# Altium schematic sheet 02-Memory.SchDoc
size A3
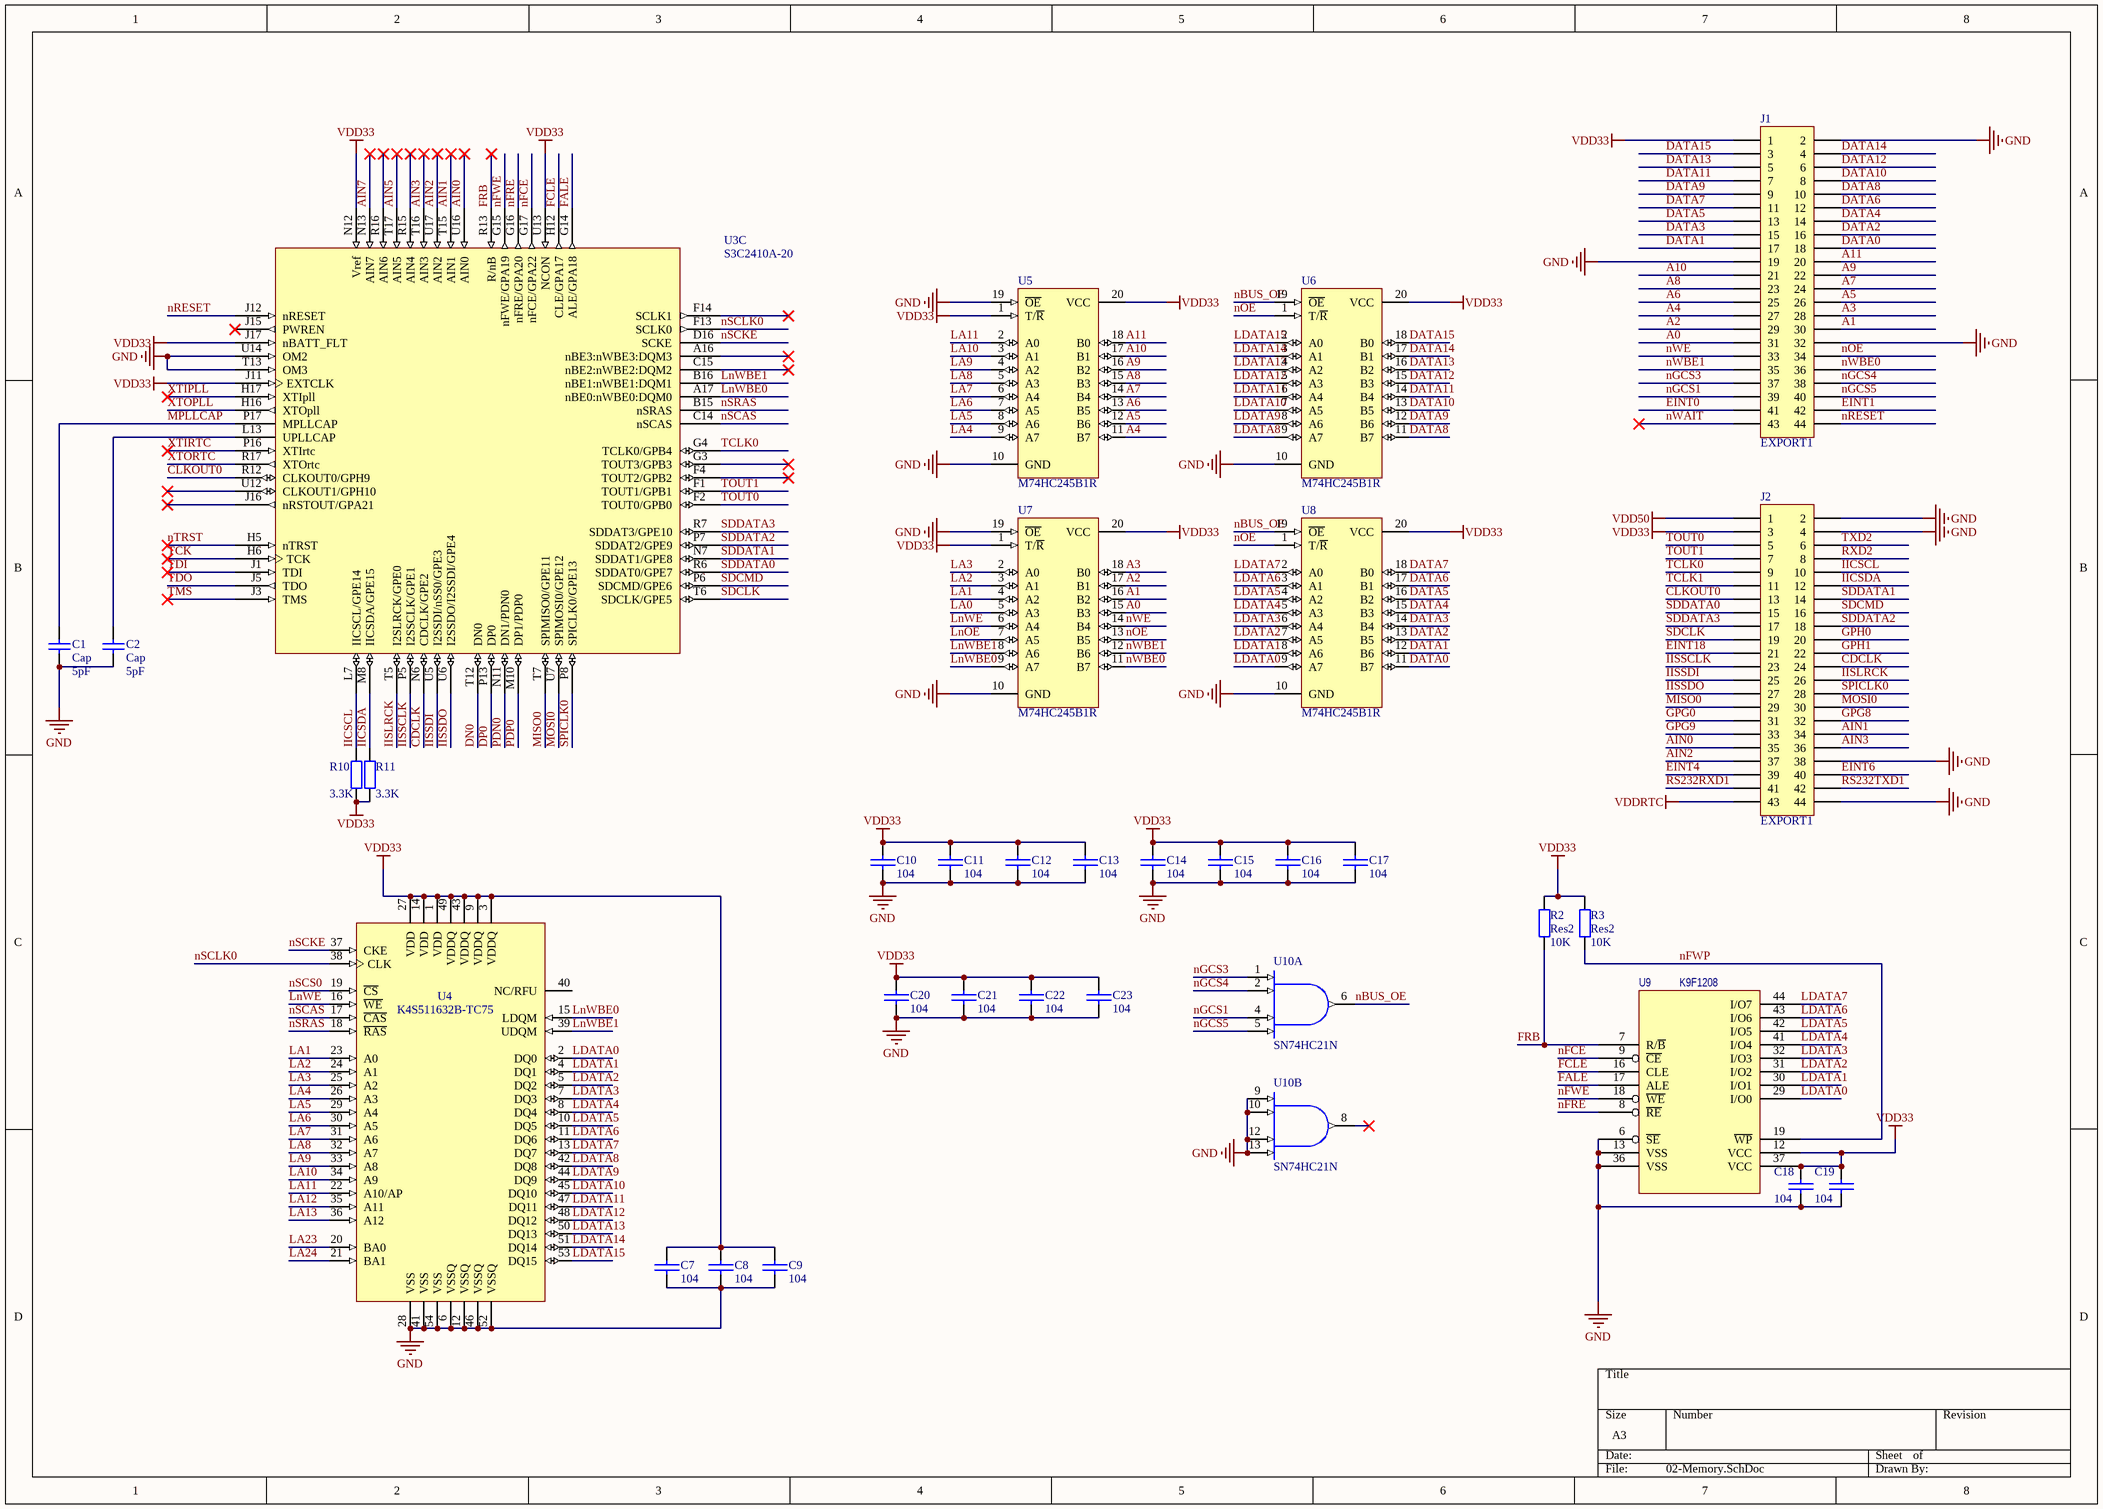
[diagram p0: 02-Memory.SchDoc]

## Parts
C1  Cap  value 5pF  [RAD-0.3]
C2  Cap  value 5pF  [RAD-0.3]
C7  104  [A型钽电容]
C8  104  [A型钽电容]
C9  104  [A型钽电容]
C10  104  [A型钽电容]
C11  104  [A型钽电容]
C12  104  [A型钽电容]
C13  104  [A型钽电容]
C14  104  [A型钽电容]
C15  104  [A型钽电容]
C16  104  [A型钽电容]
C17  104  [A型钽电容]
C18  104  [A型钽电容]
C19  104  [A型钽电容]
C20  104  [A型钽电容]
C21  104  [A型钽电容]
C22  104  [A型钽电容]
C23  104  [A型钽电容]
J1  EXPORT1  [HDR2X22]
J2  EXPORT1  [HDR2X22]
R2  Res2  value 10K  [0603R]
R3  Res2  value 10K  [0603R]
R10  value 3.3K  [0603R]  (hidden comment: Res2)
R11  value 3.3K  [0603R]  (hidden comment: Res2)
U3  S3C2410A-20  [FBGA272]  (part C of 4)
U4  K4S511632B-TC75  [54_TSOP2_400AF_N]
U5  M74HC245B1R  [SOP-20]
U6  M74HC245B1R  [SOP-20]
U7  M74HC245B1R  [SOP-20]
U8  M74HC245B1R  [SOP-20]
U9  K9F1208  [TSOP48]
U10  SN74HC21N  [N014]  (parts A,B of 2)

## Nets
GND: C1.1 C2.1 C7.2 C8.2 C9.2 C10.2 C11.2 C12.2 C13.2 C14.2 C15.2 C16.2 C17.2 C18.2 C19.2 C20.2 C21.2 C22.2 C23.2 J1.2 J1.19 J1.32 J2.2 J2.4 J2.38 J2.44 U3.T13(OM3) U3.U14(OM2) U4.6(VSSQ) U4.12(VSSQ) U4.28(VSS) U4.41(VSS) U4.46(VSSQ) U4.52(VSSQ) U4.54(VSS) U5.10(GND) U5.19(~{OE}) U6.10(GND) U7.10(GND) U7.19(~{OE}) U8.10(GND) U9.6(~{SE}) U9.13(VSS) U9.36(VSS) U10.7(GND) U10.9(A) U10.10(B) U10.12(C) U10.13(D)
VCC: U10.14(VCC)
VDD33: C7.1 C8.1 C9.1 C10.1 C11.1 C12.1 C13.1 C14.1 C15.1 C16.1 C17.1 C18.1 C19.1 C20.1 C21.1 C22.1 C23.1 J1.1 J2.3 R2.2 R3.2 R10.1 R11.1 U3.J11(EXTCLK) U3.J17(nBATT_FLT) U3.N12(Vref) U3.U13(NCON) U4.1(VDD) U4.3(VDDQ) U4.9(VDDQ) U4.14(VDD) U4.27(VDD) U4.43(VDDQ) U4.49(VDDQ) U5.1(T/~{R}) U5.20(VCC) U6.20(VCC) U7.1(T/~{R}) U7.20(VCC) U8.20(VCC) U9.12(VCC) U9.37(VCC)
VDD50: J2.1
VDDRTC: J2.43
A0: J1.31 U7.15(B3)
A1: J1.30 U7.16(B2)
A2: J1.29 U7.17(B1)
A3: J1.28 U7.18(B0)
A4: J1.27 U5.11(B7)
A5: J1.26 U5.12(B6)
A6: J1.25 U5.13(B5)
A7: J1.24 U5.14(B4)
A8: J1.23 U5.15(B3)
A9: J1.22 U5.16(B2)
A10: J1.21 U5.17(B1)
A11: J1.20 U5.18(B0)
AIN0: J2.35 U3.U16(AIN0)
AIN1: J2.34 U3.T15(AIN1)
AIN2: J2.37 U3.U17(AIN2)
AIN3: J2.36 U3.T16(AIN3)
AIN5: U3.T17(AIN5)
AIN7: U3.N13(AIN7)
CDCLK: J2.24 U3.N6(CDCLK/GPE2)
CLKOUT0: J2.13 U3.R12(CLKOUT0/GPH9)
DATA0: J1.18 U8.11(B7)
DATA1: J1.17 U8.12(B6)
DATA2: J1.16 U8.13(B5)
DATA3: J1.15 U8.14(B4)
DATA4: J1.14 U8.15(B3)
DATA5: J1.13 U8.16(B2)
DATA6: J1.12 U8.17(B1)
DATA7: J1.11 U8.18(B0)
DATA8: J1.10 U6.11(B7)
DATA9: J1.9 U6.12(B6)
DATA10: J1.8 U6.13(B5)
DATA11: J1.7 U6.14(B4)
DATA12: J1.6 U6.15(B3)
DATA13: J1.5 U6.16(B2)
DATA14: J1.4 U6.17(B1)
DATA15: J1.3 U6.18(B0)
DN0: U3.T12(DN0)
DP0: U3.P13(DP0)
EINT0: J1.41
EINT1: J1.42
EINT4: J2.39
EINT6: J2.40
EINT18: J2.21
FALE: U3.G14(ALE/GPA18) U9.17(ALE)
FCLE: U3.H12(CLE/GPA17) U9.16(CLE)
FRB: R2.1 U3.R13(R/nB) U9.7(R/~{B})
GPG0: J2.31
GPG8: J2.32
GPG9: J2.33
GPH0: J2.20
GPH1: J2.22
IICSCL: J2.10 R10.2 U3.L7(IICSCL/GPE14)
IICSDA: J2.12 R11.2 U3.M8(IICSDA/GPE15)
IISLRCK: J2.26 U3.T5(I2SLRCK/GPE0)
IISSCLK: J2.23 U3.P5(I2SSCLK/GPE1)
IISSDI: J2.25 U3.U5(I2SSDI/nSS0/GPE3)
IISSDO: J2.27 U3.U6(I2SSDO/I2SSDI/GPE4)
LA0: U7.5(A3)
LA1: U4.23(A0) U7.4(A2)
LA2: U4.24(A1) U7.3(A1)
LA3: U4.25(A2) U7.2(A0)
LA4: U4.26(A3) U5.9(A7)
LA5: U4.29(A4) U5.8(A6)
LA6: U4.30(A5) U5.7(A5)
LA7: U4.31(A6) U5.6(A4)
LA8: U4.32(A7) U5.5(A3)
LA9: U4.33(A8) U5.4(A2)
LA10: U4.34(A9) U5.3(A1)
LA11: U4.22(A10/AP) U5.2(A0)
LA12: U4.35(A11)
LA13: U4.36(A12)
LA23: U4.20(BA0)
LA24: U4.21(BA1)
LDATA0: U4.2(DQ0) U8.9(A7) U9.29(I/O0)
LDATA1: U4.4(DQ1) U8.8(A6) U9.30(I/O1)
LDATA2: U4.5(DQ2) U8.7(A5) U9.31(I/O2)
LDATA3: U4.7(DQ3) U8.6(A4) U9.32(I/O3)
LDATA4: U4.8(DQ4) U8.5(A3) U9.41(I/O4)
LDATA5: U4.10(DQ5) U8.4(A2) U9.42(I/O5)
LDATA6: U4.11(DQ6) U8.3(A1) U9.43(I/O6)
LDATA7: U4.13(DQ7) U8.2(A0) U9.44(I/O7)
LDATA8: U4.42(DQ8) U6.9(A7)
LDATA9: U4.44(DQ9) U6.8(A6)
LDATA10: U4.45(DQ10) U6.7(A5)
LDATA11: U4.47(DQ11) U6.6(A4)
LDATA12: U4.48(DQ12) U6.5(A3)
LDATA13: U4.50(DQ13) U6.4(A2)
LDATA14: U4.51(DQ14) U6.3(A1)
LDATA15: U4.53(DQ15) U6.2(A0)
LnOE: U7.7(A5)
LnWBE0: U3.A17(nBE0:nWBE0:DQM0) U4.15(LDQM) U7.9(A7)
LnWBE1: U3.B16(nBE1:nWBE1:DQM1) U4.39(UDQM) U7.8(A6)
LnWE: U4.16(~{WE}) U7.6(A4)
MISO0: J2.29 U3.T7(SPIMISO0/GPE11)
MOSI0: J2.30 U3.U7(SPIMOSI0/GPE12)
MPLLCAP: C1.2 U3.P17(MPLLCAP)
nBUS_OE: U6.19(~{OE}) U8.19(~{OE}) U10.6(Y)
nFCE: U3.G17(nFCE/GPA22) U9.9(~{CE})
nFRE: U3.G16(nFRE/GPA20) U9.8(~{RE})
nFWE: U3.G15(nFWE/GPA19) U9.18(~{WE})
nFWP: R3.1 U9.19(~{WP})
nGCS1: J1.39 U10.4(C)
nGCS3: J1.37 U10.1(A)
nGCS4: J1.38 U10.2(B)
nGCS5: J1.40 U10.5(D)
nOE: J1.34 U6.1(T/~{R}) U7.13(B5) U8.1(T/~{R})
nRESET: J1.44 U3.J12(nRESET)
nSCAS: U3.C14(nSCAS) U4.17(~{CAS})
nSCKE: U3.D16(SCKE) U4.37(CKE)
nSCLK0: U3.F13(SCLK0) U4.38(CLK)
nSCS0: U4.19(~{CS})
nSRAS: U3.B15(nSRAS) U4.18(~{RAS})
nTRST: U3.H5(nTRST)
nWAIT: J1.43
nWBE0: J1.36 U7.11(B7)
nWBE1: J1.35 U7.12(B6)
nWE: J1.33 U7.14(B4)
PDN0: U3.N11(DN1/PDN0)
PDP0: U3.M10(DP1/PDP0)
RS232RXD1: J2.41
RS232TXD1: J2.42
RXD2: J2.8
SDCLK: J2.19 U3.T6(SDCLK/GPE5)
SDCMD: J2.16 U3.P6(SDCMD/GPE6)
SDDATA0: J2.15 U3.R6(SDDAT0/GPE7)
SDDATA1: J2.14 U3.N7(SDDAT1/GPE8)
SDDATA2: J2.18 U3.P7(SDDAT2/GPE9)
SDDATA3: J2.17 U3.R7(SDDAT3/GPE10)
SPICLK0: J2.28 U3.P8(SPICLK0/GPE13)
TCK: U3.H6(TCK)
TCLK0: J2.9 U3.G4(TCLK0/GPB4)
TCLK1: J2.11
TDI: U3.J1(TDI)
TDO: U3.J5(TDO)
TMS: U3.J3(TMS)
TOUT0: J2.5 U3.F2(TOUT0/GPB0)
TOUT1: J2.7 U3.F1(TOUT1/GPB1)
TXD2: J2.6
XTIPLL: U3.H17(XTIpll)
XTIRTC: U3.P16(XTIrtc)
XTOPLL: U3.H16(XTOpll)
XTORTC: U3.R17(XTOrtc)
NetC2_2: C2.2 U3.L13(UPLLCAP)

Not connected (* = marked no-connect by the designer): U3 A16(nBE3:nWBE3:DQM3)* C15(nBE2:nWBE2:DQM2)* F4(TOUT2/GPB2)* F14(SCLK1)* G3(TOUT3/GPB3)* J15(PWREN)* J16(nRSTOUT/GPA21)* R15(AIN4)* R16(AIN6)* U12(CLKOUT1/GPH10)*; U4 40(NC/RFU); U10 8(Y)*

## Library data of the parts
C1 C2 = Cap: Capacitor; Published: 8-Jun-2000; LatestRevisionDate: 17-Jul-2002; LatestRevisionNote: Re-released for DXP Platform.; PackageReference: RAD-0.3; Publisher: Altium Limited; PackageDescription: Radial Cap, Thru-Hole; 2 Leads; 0.3 in Pin Spacing
C7-C23 = CAP_1: Capacitor
J1 J2 = Header 22X2: Header, 22-Pin, Dual row; LatestRevisionDate: 17-Jul-2002; LatestRevisionNote: Re-released for DXP Platform.; Publisher: Altium Limited
R2 R3 = Res2: Resistor; Published: 8-Jun-2000; LatestRevisionDate: 17-Jul-2002; LatestRevisionNote: Re-released for DXP Platform.; PackageReference: AXIAL-0.4; Publisher: Altium Limited
R10 R11 = Res2_1: Resistor; Published: 8-Jun-2000; LatestRevisionDate: 17-Jul-2002; LatestRevisionNote: Re-released for DXP Platform.; PackageReference: AXIAL-0.4; Publisher: Altium Limited
U3 = S3C2410A-20: 32-Bit RISC Microprocessor, 200 MHz, 1.8V (Core), 3.3V (Memory and IO), 272-Pin FBGA; Published: 6-Oct-2005; LatestRevisionDate: 13-Apr-2006; LatestRevisionNote: IPC-7351 Footprint Added.; DatasheetVersion: rev1.0, Mar-2004; PackageVersion: Mar-2004; PackageReference: FBGA272; Publisher: Altium Limited; PackageDescription: 272-Ball Ball Grid Array 0.8 mm Pitch; ComponentLink1Description: Manufacturer Link; ComponentLink1URL: http://www.samsung.com; ComponentLink2Description: Datasheet; ComponentLink2URL: http://www.samsung.com/Products/Semiconductor/SystemLSI/MobileSolutions/MobileASSP/MobileComputing/S3C2410/um_s3c2410a_manual_r10.pdf
U4 = K4S511632B-TC75: 512Mb Synchronous High Data Rate DRAM, 8Mb x 16Bit x 4 Banks, 54-Pin TSOP; Frequency: 133MHz (max); RowAddress: A0-A12; ColumnAddress: A0-A9; Published: 11-Oct-2004; LatestRevisionDate: 13-Apr-2006; LatestRevisionNote: IPC-7351 Footprint Added.; DatasheetVersion: rev1.1, Feb-2004; PackageVersion: Aug-2004; PackageReference: 54_TSOP2_400AF; Publisher: Altium Limited; PackageDescription: 54-Pin Small Outline Package 0.8 mm Pitch; ComponentLink1Description: Manufacturer Link; ComponentLink1URL: http://www.samsung.com; ComponentLink2Description: Datasheet; ComponentLink2URL: http://www.samsung.com/Products/Semiconductor/DRAM/SDRAM/SDRAMcomponent/512Mbit/K4S510432B/ds_sdr_512mb_b-die_x4x8x16_11.pdf
U5-U8 = M74HC245B1R: Octal Bus Transceiver 3-State Non-Inverting; Published: 8-Jun-2000; LatestRevisionDate: 06-Jun-2005; LatestRevisionNote: Stylized 3D Model Added.; DatasheetVersion: Oct-1993; PackageVersion: Jun-1998; PackageReference: DIP20; Publisher: Altium Limited; PackageDescription: DIP; 20 Leads; Row Spacing 7.62 mm; Pitch 2.54 mm; Code_JEDEC: MS-015-AE; ComponentLink1Description: Manufacturer Link; ComponentLink1URL: http://www.st.com/; ComponentLink2Description: Datasheet; ComponentLink2URL: http://www.st.com/stonline/products/literature/ds/1930/m74hc245.pdf
U9 = K9F2808
U10 = SN74HC21N: Dual 4-Input Positive-AND Gate; Note: Pins 3 and 11 are not connected and not drawn; Published: 8-Jun-2000; LatestRevisionDate: 04-Mar-2005; LatestRevisionNote: Stylized 3D Model Added.; DatasheetVersion: May-1997; PackageVersion: Oct-1995; PackageReference: N014; Publisher: Altium Limited; PackageDescription: DIP; 14 Leads; Row Spacing 7.62 mm; Pitch 2.54 mm; ComponentLink1Description: Manufacturer Link; ComponentLink1URL: http://www.ti.com/; ComponentLink2Description: Datasheet; ComponentLink2URL: http://www-s.ti.com/sc/ds/SN74HC21.pdf